# Altium project PCB_esp32-12F.PrjPcb
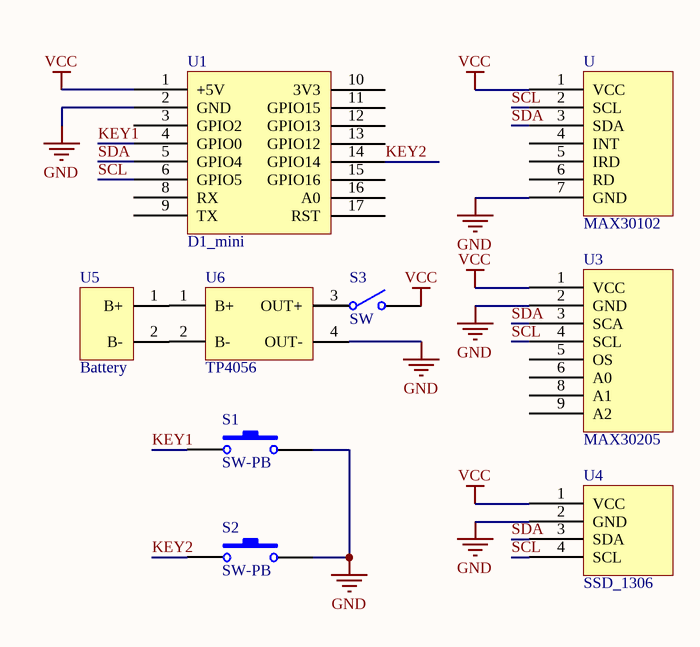
[diagram p0: Sheet1.SchDoc]
1 sheet, 9 parts. Net scope: global (net labels, ports and power ports of the same name join across sheets).

## Sheet Sheet1.SchDoc
size A4; SheetNumber: 1; SheetTotal: 1

### Parts
S1  SW-PB  [SPST-2]
S2  SW-PB  [SPST-2]
S3  SW  [SPST-2]
U  MAX30102
U1  D1_mini
U3  MAX30205
U4  SSD_1306
U5  Battery
U6  TP4056

### Nets
GND: S1.2 S2.2 U.7(GND) U1.2(GND) U3.2(GND) U4.2(GND) U6.4(OUT-)
VCC: S3.2(NO) U.1(VCC) U1.1(+5V) U3.1(VCC) U4.1(VCC)
KEY1: S1.1 U1.4(GPIO0)
KEY2: S2.1 U1.14(GPIO14)
SCL: U.2(SCL) U1.6(GPIO5) U3.4(SCL) U4.4(SCL)
SDA: U.3(SDA) U1.5(GPIO4) U3.3(SCA) U4.3(SDA)
NetU5_1: U5.1(B+) U6.1(B+)
NetU5_2: U5.2(B-) U6.2(B-)

Not connected (* = marked no-connect by the designer): S3 1(COMMON); U 4(INT) 5(IRD) 6(RD); U1 3(GPIO2) 8(RX) 9(TX) 10(3V3) 11(GPIO15) 12(GPIO13) 13(GPIO12) 15(GPIO16) 16(A0) 17(RST); U3 5(OS) 6(A0) 8(A1) 9(A2); U6 3(OUT+)

### Library data of the parts
S1 S2 = SW-PB: Switch; Published: 24-Mar-1999; LatestRevisionDate: 17-Jul-2002; LatestRevisionNote: Re-released for DXP Platform.; PackageReference: SPST-2; Publisher: Altium Limited; PackageDescription: Switch; 2 Leads
S3 = SW-SPST: Single-Pole, Single-Throw Switch; Published: 24-Mar-1999; LatestRevisionDate: 17-Jul-2002; LatestRevisionNote: Re-released for DXP Platform.; PackageReference: SPST-2; Publisher: Altium Limited; PackageDescription: Switch; 2 Leads